# Altium schematic sheet SCH-Unified_Sheet_2_Altium.schdoc
size 257 x 156 mm
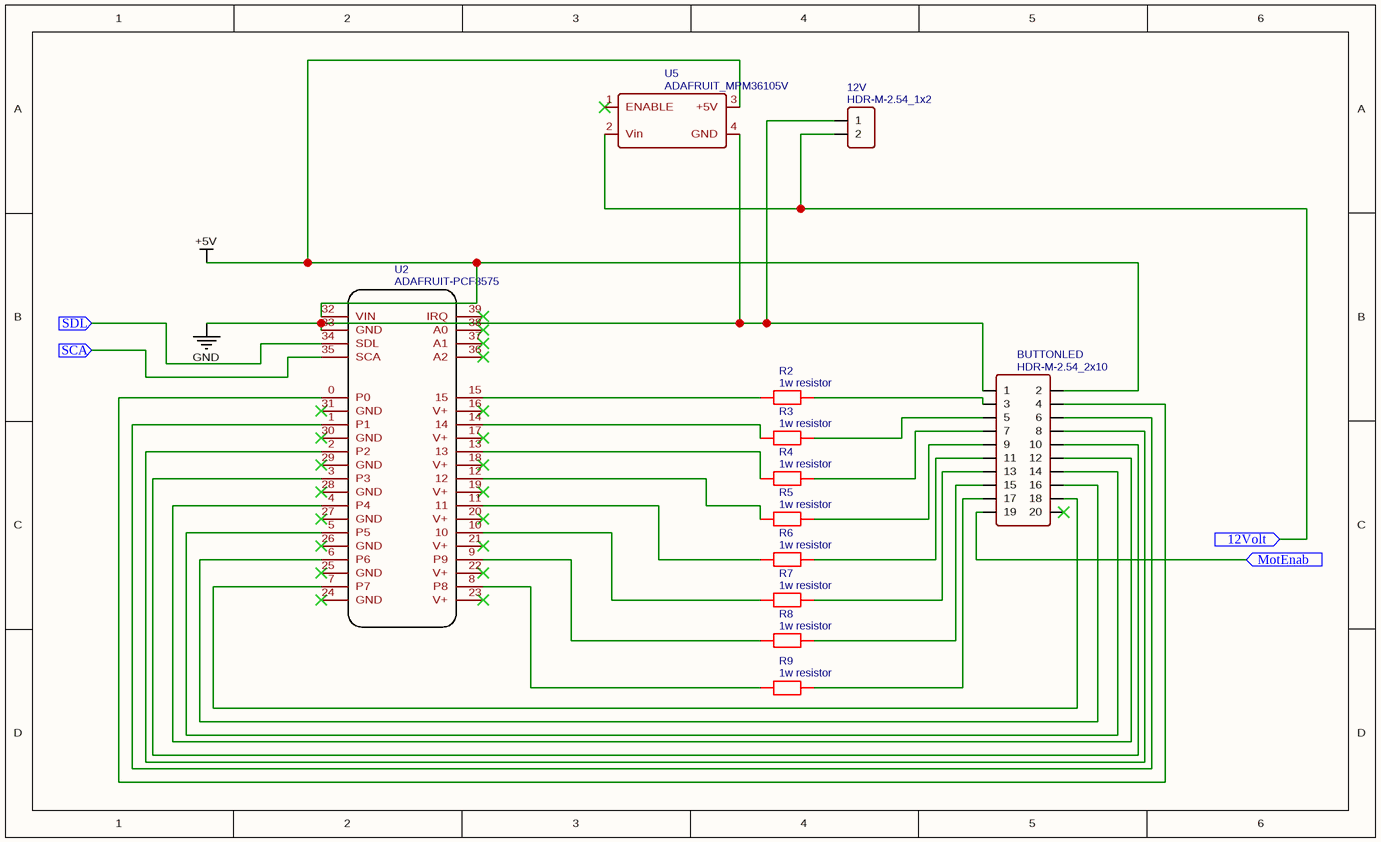
[diagram p0: SCH-Unified_Sheet_2_Altium.schdoc]

## Parts
12V  HDR-M-2.54_1x2  [HDR-M-2.54_1X2]
BUTTONLED  HDR-M-2.54_2x10  [HDR-M-2.54_2X10]
R2  1w resistor  [2W RESITOR]
R3  1w resistor  [2W RESITOR]
R4  1w resistor  [2W RESITOR]
R5  1w resistor  [2W RESITOR]
R6  1w resistor  [2W RESITOR]
R7  1w resistor  [2W RESITOR]
R8  1w resistor  [2W RESITOR]
R9  1w resistor  [2W RESITOR]
U2  ADAFRUIT-PCF8575  [ADAFRUIT-PCF8575]
U5  ADAFRUIT_MPM36105V  [ADAFRUIT_MPM3610_MODULE5]

## Ports
12Volt (in), MotEnab (in), SCA (in), SDL (in)

## Nets
+5V: BUTTONLED.2 U2.32(VIN) U5.3(+5V)
GND: 12V.1 BUTTONLED.1 U2.33(GND) U5.4(GND)
12Volt: 12V.2 U5.2(Vin) ; port 12Volt
MotEnab: BUTTONLED.19 ; port MotEnab
SCA: U2.35(SCA) ; port SCA
SDL: U2.34(SDL) ; port SDL
NetBUTTONLED_3: BUTTONLED.3 R2.2
NetBUTTONLED_4: BUTTONLED.4 U2.0(P0)
NetBUTTONLED_5: BUTTONLED.5 R3.2
NetBUTTONLED_6: BUTTONLED.6 U2.1(P1)
NetBUTTONLED_7: BUTTONLED.7 R4.2
NetBUTTONLED_8: BUTTONLED.8 U2.2(P2)
NetBUTTONLED_9: BUTTONLED.9 R5.2
NetBUTTONLED_10: BUTTONLED.10 U2.3(P3)
NetBUTTONLED_11: BUTTONLED.11 R6.2
NetBUTTONLED_12: BUTTONLED.12 U2.4(P4)
NetBUTTONLED_13: BUTTONLED.13 R7.2
NetBUTTONLED_14: BUTTONLED.14 U2.5(P5)
NetBUTTONLED_15: BUTTONLED.15 R8.2
NetBUTTONLED_16: BUTTONLED.16 U2.6(P6)
NetBUTTONLED_17: BUTTONLED.17 R9.2
NetBUTTONLED_18: BUTTONLED.18 U2.7(P7)
NetR2_1: R2.1 U2.15
NetR3_1: R3.1 U2.14
NetR4_1: R4.1 U2.13
NetR5_1: R5.1 U2.12
NetR6_1: R6.1 U2.11
NetR7_1: R7.1 U2.10
NetR8_1: R8.1 U2.9(P9)
NetR9_1: R9.1 U2.8(P8)

Not connected (* = marked no-connect by the designer): BUTTONLED 20*; U2 16(V+)* 17(V+)* 18(V+)* 19(V+)* 20(V+)* 21(V+)* 22(V+)* 23(V+)* 24(GND)* 25(GND)* 26(GND)* 27(GND)* 28(GND)* 29(GND)* 30(GND)* 31(GND)* 36(A2)* 37(A1)* 38(A0)* 39(IRQ)*; U5 1(ENABLE)*

## Library data of the parts
12V = HDR-M-2.54_1x2: Contributor: LCEDA_Lib; Supplier Part: C124375; Supplier: LCSC; spicePre: J; spiceSymbolName: HDR-M-2.54_1x2
BUTTONLED = HDR-M-2.54_2x10: Contributor: LCEDA_Lib; Supplier Part: C124359; Supplier: LCSC; spicePre: J; spiceSymbolName: HDR-M-2.54_2x10
R2-R9 = 1w resistor: Contributor: Kagutsuchi; spicePre: R; spiceSymbolName: 1w resistor
U2 = ADAFRUIT-PCF8575: Contributor: williambaucom; spicePre: U; spiceSymbolName: ADAFRUIT-PCF8575
U5 = ADAFRUIT_MPM36105V: Contributor: Aidan Farley; Supplier: Digi-Key; JLCPCB Part Class: Extended Part; spicePre: U; spiceSymbolName: ADAFRUIT_MPM36105V